# Altium schematic sheet SchematicLM386.schdoc
size 206 x 144 mm
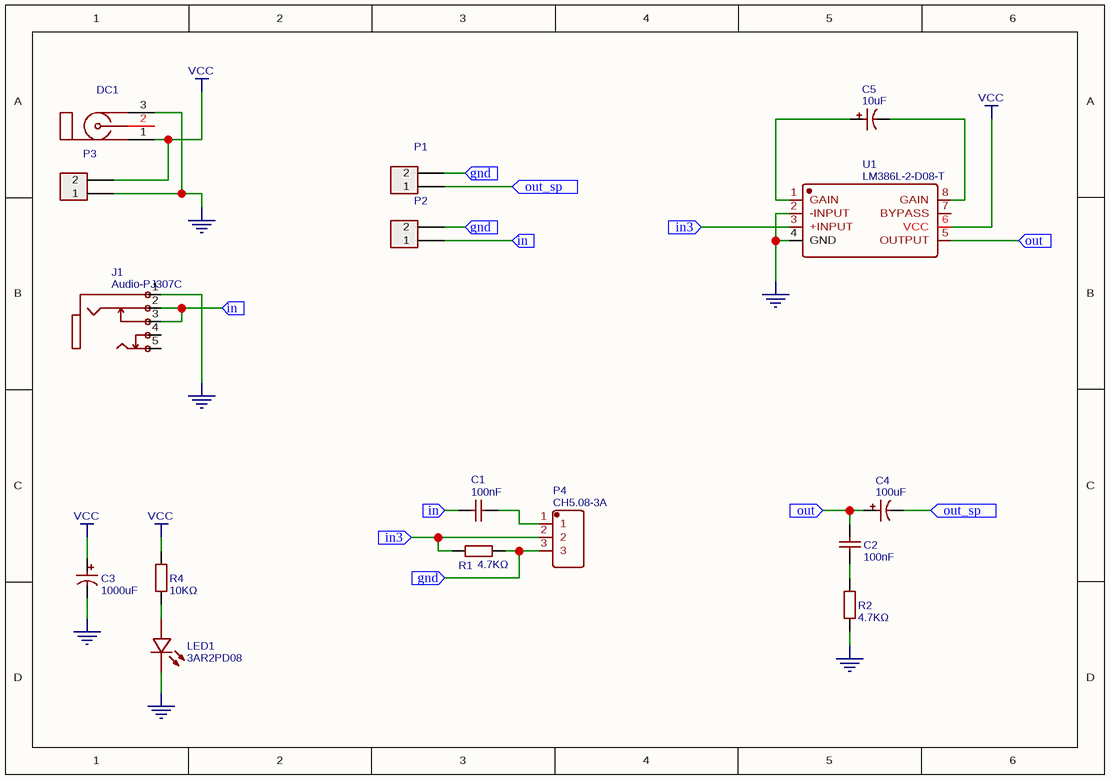
[diagram p0: SchematicLM386.schdoc]

## Parts
C1  100nF  [RAD-0.1]
C2  100nF  [RAD-0.1]
C3  1000uF  [CAP-D10.0XF5.0]
C4  100uF  [CAP-D8.0XF3.5]
C5  10uF  [CAP-D5.0XF2.0]
DC1  DC-005_1  [DC-5020]  (value not drawn)
J1  Audio-PJ307C  [AUDIO-PJ307C]
LED1  3AR2PD08  [LED-3MM]
P1  Header-Female-2.54_1x2  [HDR-1X2/2.54]  (value not drawn)
P2  Header-Female-2.54_1x2  [HDR-1X2/2.54]  (value not drawn)
P3  Header-Female-2.54_1x2  [HDR-1X2/2.54]  (value not drawn)
P4  CH5.08-3A  [CH5.08-3A]
R1  4.7KΩ  [AXIAL-0.4]
R2  4.7KΩ  [AXIAL-0.4]
R4  10KΩ  [AXIAL-0.4]
U1  LM386L-2-D08-T  [DIP-8]

## Ports
gnd (in), in3 (in), in (in), out (in), out_sp (in)

## Nets
GND: C3.2 DC1.3 J1.1 LED1.1(K) P3.1 R2.1 U1.2(-INPUT) U1.4(GND)
VCC: C3.1 DC1.1 P3.2 R4.2 U1.6(VCC)
gnd: P1.2 P2.2 P4.3 R1.2 ; port gnd  [a separate net that carries the same name]
in: C1.1 J1.2 J1.3 P2.1 ; port in
in3: P4.2 R1.1 U1.3(+INPUT) ; port in3
out: C2.2 C4.1 U1.5(OUTPUT) ; port out
out_sp: C4.2 P1.1 ; port out_sp
NetC1_2: C1.2 P4.1
NetC2_1: C2.1 R2.2
NetC5_1: C5.1 U1.1(GAIN)
NetC5_2: C5.2 U1.8(GAIN)
NetLED1_2: LED1.2(A) R4.1

Not connected (* = marked no-connect by the designer): DC1 2(VCC); J1 4 5; U1 7(BYPASS)

## Library data of the parts
C1 C2 = 100nF: BOM_Manufacturer: ReliaPro; BOM_Manufacturer Part: CS1F5.6Y5V1A104Z; Voltage: 50V; Tolerance: -20%; Value: 100nF; BOM_Supplier: LCSC; spicePre: C; BOM_Supplier Part: C9306
C3 = 1000uF: BOM_Manufacturer: CapXon; BOM_Manufacturer Part: KM102M025G160A; Voltage: 25V; Value: 1000uF; BOM_Supplier: LCSC; spicePre: C; BOM_Supplier Part: C59381
C4 = 100uF: BOM_Manufacturer: CapXon; BOM_Manufacturer Part: KM101M050F115A; Voltage: 50V; Value: 100uF; BOM_Supplier: LCSC; spicePre: C; BOM_Supplier Part: C59414
C5 = 10uF: BOM_Manufacturer: ValuePro; BOM_Manufacturer Part: 10uF 25V 5*11; Voltage: 25V; Value: 10uF; BOM_Supplier: LCSC; spicePre: C; BOM_Supplier Part: C43347
DC1 = DC-005_1: BOM_Manufacturer: ReliaPro; BOM_Manufacturer Part: DC-005Full copper power outlet 2.0mm; BOM_Supplier: LCSC; spicePre: D; BOM_Supplier Part: C66437
J1 = Audio-PJ307C: BOM_Manufacturer: ReliaPro; BOM_Manufacturer Part: PJ-307C; BOM_Supplier: LCSC; spicePre: J; BOM_Supplier Part: C16684
LED1 = 3AR2PD08: BOM_Manufacturer: ReliaPro; BOM_Supplier: LCSC; BOM_Manufacturer Part: 3AR2PD08; spicePre: L; BOM_Supplier Part: C13407
P1-P3 = Header-Female-2.54_1x2: BOM_Manufacturer: LCSC; BOM_Supplier: LCSC; BOM_Manufacturer Part: Header-Female-2.54_1x2; spicePre: P; BOM_Supplier Part: C49661
P4 = CH5.08-3A: BOM_Manufacturer: ReliaPro; spicePre: X; BOM_Supplier: LCSC; BOM_Manufacturer Part: CH5.08-3A; BOM_Supplier Part: C23514
R1 R2 = 4.7KΩ: BOM_Manufacturer: UniOhm; BOM_Manufacturer Part: MFR0W4F4701A50; Power: 1/4W; Tolerance: ±1%; Value: 4.7KΩ; BOM_Supplier: LCSC; spicePre: R; BOM_Supplier Part: C57204
R4 = 10KΩ: BOM_Manufacturer Part: CFR0W4J0103A50; BOM_Manufacturer: UniOhm; Power: 1/4W; Tolerance: ±5%; Value: 10KΩ; BOM_Supplier: LCSC; spicePre: R; BOM_Supplier Part: C61299
U1 = LM386L-2-D08-T: BOM_Manufacturer: UTC; spicePre: X; BOM_Supplier: LCSC; BOM_Manufacturer Part: LM386L-2-D08-T; BOM_Supplier Part: C87306